# EAGLE board MBot (EAGLE 6.2), part 1 of 2
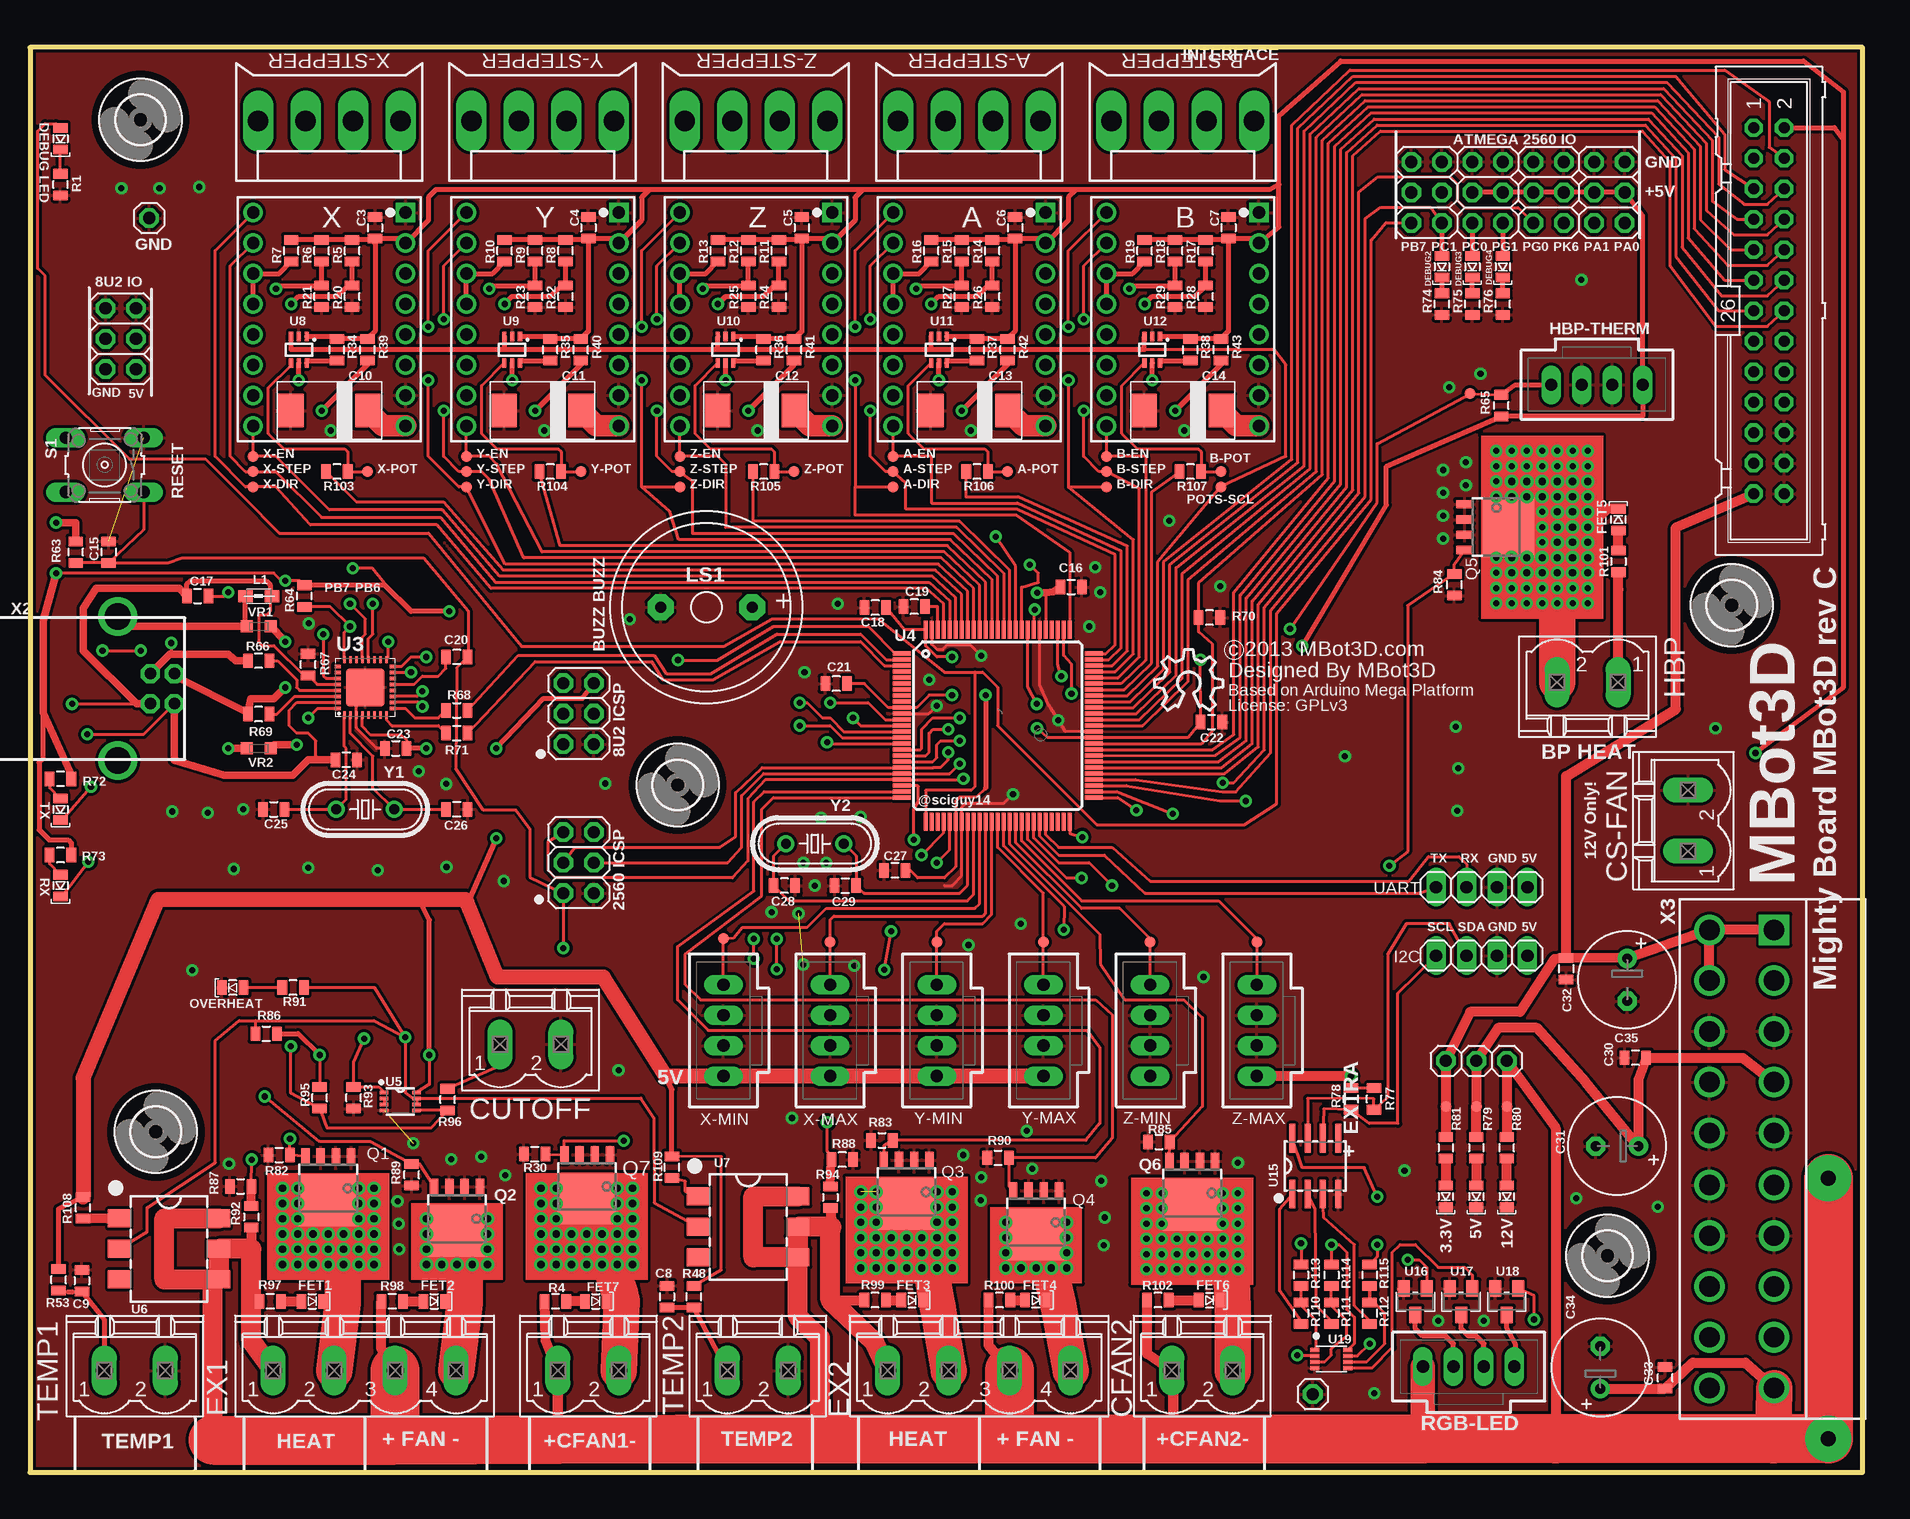
[diagram p2: board, top side]
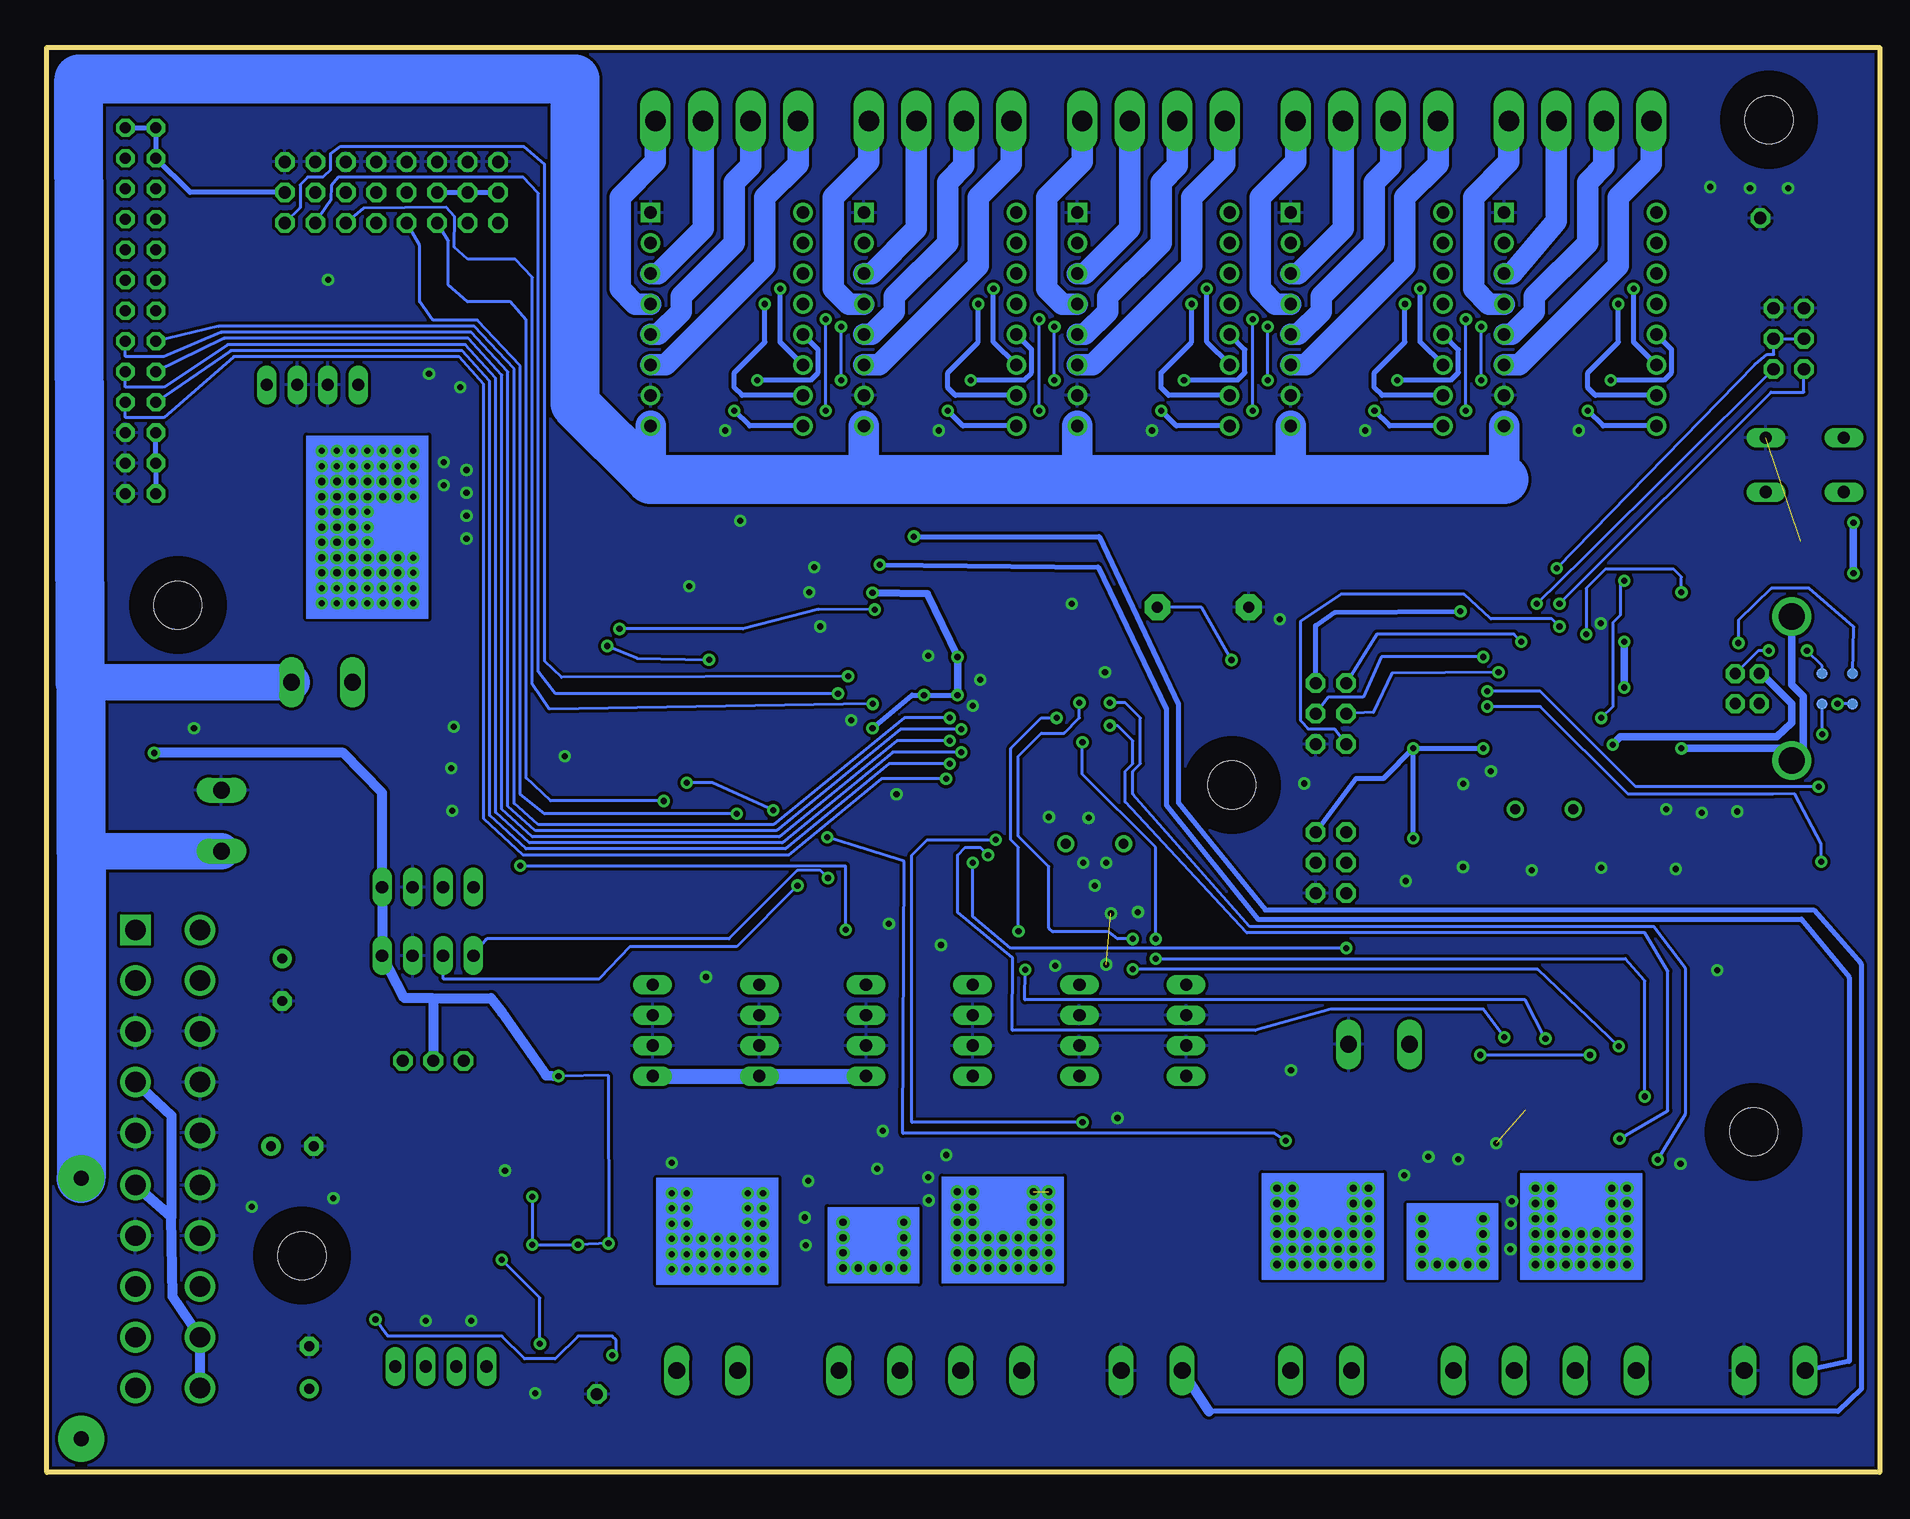
[diagram p3: board, bottom side, seen from below]

Size 152.72 x 118.75 mm. Coordinates in mm from the lower left corner, seen from the top.
Outline: 0,0 152.72,0 152.72,118.75 0,118.75 0,0
Copper layers (1*16): Top 0.035mm / dielectric 1.5mm / Bottom 0.035mm
Design rules: minimum track width 8mil, minimum drill 20mil, track to track 4mil, track to pad 4mil, pad to pad 4mil, via to via 4mil, smd to smd 0mil, copper to edge 10mil, drill to drill 8mil, minimum pad ring 12mil, minimum via ring 10mil, stop-mask expansion 4mil, vias tented up to drill 25mil, thermal gap 10mil
Net classes: 0 default: width 0.203 mm, drill 0.508 mm, clearance 0.203 mm; 1 24V: width 0.889 mm, drill 0.635 mm, clearance 0.508 mm; 2 gnd: width 0.381 mm, drill 0.508 mm, clearance 0.254 mm; 3 5V: width 0.381 mm, drill 0.508 mm, clearance 0.254 mm; 4 3.3V: width 0.381 mm, drill 0.508 mm, clearance 0.254 mm; 5 DC Motor: width 0.762 mm, drill 0.635 mm, clearance 0.254 mm

## Footprints (pad centres in the part's own frame; a part is rotated, then mirrored left to right if it is on the bottom)
LED-0805 = smd 1.2 x 0.8: A 0,-0.9; C 0,0.9
4,0HOLE-3,0KEEPOUT = hole 4: 0,0
MSTBV2 = drill 1.397 long: 1 -2.54,0; 2 2.54,0
TP09R = smd 0.9 x 0.9: TP 0,0
KK-156-4 = drill 1.7 pad 2.184 long: 1 -5.94,0; 2 -1.98,0; 3 1.98,0; 4 5.94,0
BOTSTEP17-INV = drill 1.016 square: 1 6.35,8.89 | drill 1.016: 2 6.35,6.35; 3 6.35,3.81; 4 6.35,1.27; 5 6.35,-1.27; 6 6.35,-3.81; 7 6.35,-6.35; 8 6.35,-8.89; 9 -6.35,-8.89; 10 -6.35,-6.35; 11 -6.35,-3.81; 12 -6.35,-1.27; 13 -6.35,1.27; 14 -6.35,3.81; 15 -6.35,6.35; 16 -6.35,8.89
0805 = smd 0.8 x 1.2: 1 -0.9,0; 2 0.9,0
CAP2917 = smd 2.1 x 2.8: 1 -3.2,0; 2 3.2,0
E3,5-8 = drill 0.813 pad 1.6: + -1.778,0 | drill 0.813 pad 1.6 octagon: - 1.778,0
MSTBV4 = drill 1.397 long: 1 -7.62,0; 2 -2.54,0; 3 2.54,0; 4 7.62,0
70543-04 = drill 1.016 long: 1 -3.81,0; 2 -1.27,0; 3 1.27,0; 4 3.81,0
1X04 = drill 1.016 long: 1 -3.81,0; 2 -1.27,0; 3 1.27,0; 4 3.81,0
2X03 = drill 1.016 octagon: 1 -2.54,-1.27; 2 -2.54,1.27; 3 0,-1.27; 4 0,1.27; 5 2.54,-1.27; 6 2.54,1.27
ML26 = drill 0.914 octagon: 1 -15.24,-1.27; 2 -15.24,1.27; 3 -12.7,-1.27; 4 -12.7,1.27; 5 -10.16,-1.27; 6 -10.16,1.27; 7 -7.62,-1.27; 8 -7.62,1.27; 9 -5.08,-1.27; 10 -5.08,1.27; 11 -2.54,-1.27; 12 -2.54,1.27; 13 0,-1.27; 14 0,1.27; 15 2.54,-1.27; 16 2.54,1.27; 17 5.08,-1.27; 18 5.08,1.27; 19 7.62,-1.27; 20 7.62,1.27; 21 10.16,-1.27; 22 10.16,1.27; 23 12.7,-1.27; 24 12.7,1.27; 25 15.24,-1.27; 26 15.24,1.27
1X01 = drill 1.016 octagon: 1 0,0
0805' = smd 1.2 x 1: 1 -1.1,0; 2 1.1,0
F/QMB = drill 0.914 pad 2.159 octagon: + 3.81,0; - -3.81,0
SOT669 = smd 0.7 x 1.4: 1 -1.905,-3.92; 2 -0.635,-3.92; 3 0.635,-3.92; 4 1.905,-3.92 | smd 5 x 4.3: MB 0,-0.27
B3F-10XX = drill 1.016 long: 1 -3.251,2.261; 2 3.251,2.261; 3 -3.251,-2.261; 4 3.251,-2.261
QFN32 = smd 0.6 x 0.3: 1 -2.3,1.75; 2 -2.3,1.25; 3 -2.3,0.75; 4 -2.3,0.25; 5 -2.3,-0.25; 6 -2.3,-0.75; 7 -2.3,-1.25; 8 -2.3,-1.75; 17 2.3,-1.75; 18 2.3,-1.25; 19 2.3,-0.75; 20 2.3,-0.25; 21 2.3,0.25; 22 2.3,0.75; 23 2.3,1.25; 24 2.3,1.75 | smd 0.3 x 0.6: 9 -1.75,-2.3; 10 -1.25,-2.3; 11 -0.75,-2.3; 12 -0.25,-2.3; 13 0.25,-2.3; 14 0.75,-2.3; 15 1.25,-2.3; 16 1.75,-2.3; 25 1.75,2.3; 26 1.25,2.3; 27 0.75,2.3; 28 0.25,2.3; 29 -0.25,2.3; 30 -0.75,2.3; 31 -1.25,2.3; 32 -1.75,2.3 | smd 3.2 x 3.2: EXP 0,0
TQFP100 = smd 1.5 x 0.35: 1 -8,6; 2 -8,5.5; 3 -8,5; 4 -8,4.5; 5 -8,4; 6 -8,3.5; 7 -8,3; 8 -8,2.5; 9 -8,2; 10 -8,1.5; 11 -8,1; 12 -8,0.5; 13 -8,0; 14 -8,-0.5; 15 -8,-1; 16 -8,-1.5; 17 -8,-2; 18 -8,-2.5; 19 -8,-3; 20 -8,-3.5; 21 -8,-4; 22 -8,-4.5; 23 -8,-5; 24 -8,-5.5; 25 -8,-6; 51 8,-6; 52 8,-5.5; 53 8,-5; 54 8,-4.5; 55 8,-4; 56 8,-3.5; 57 8,-3; 58 8,-2.5; 59 8,-2; 60 8,-1.5; 61 8,-1; 62 8,-0.5; 63 8,0; 64 8,0.5; 65 8,1; 66 8,1.5; 67 8,2; 68 8,2.5; 69 8,3; 70 8,3.5; 71 8,4; 72 8,4.5; 73 8,5; 74 8,5.5; 75 8,6 | smd 0.35 x 1.5: 26 -6,-8; 27 -5.5,-8; 28 -5,-8; 29 -4.5,-8; 30 -4,-8; 31 -3.5,-8; 32 -3,-8; 33 -2.5,-8; 34 -2,-8; 35 -1.5,-8; 36 -1,-8; 37 -0.5,-8; 38 0,-8; 39 0.5,-8; 40 1,-8; 41 1.5,-8; 42 2,-8; 43 2.5,-8; 44 3,-8; 45 3.5,-8; 46 4,-8; 47 4.5,-8; 48 5,-8; 49 5.5,-8; 50 6,-8; 76 6,8; 77 5.5,8; 78 5,8; 79 4.5,8; 80 4,8; 81 3.5,8; 82 3,8; 83 2.5,8; 84 2,8; 85 1.5,8; 86 1,8; 87 0.5,8; 88 0,8; 89 -0.5,8; 90 -1,8; 91 -1.5,8; 92 -2,8; 93 -2.5,8; 94 -3,8; 95 -3.5,8; 96 -4,8; 97 -4.5,8; 98 -5,8; 99 -5.5,8; 100 -6,8
US8 = smd 0.3 x 0.7: 1 -0.75,-1.35; 2 -0.25,-1.35; 3 0.25,-1.35; 4 0.75,-1.35; 5 0.75,1.35; 6 0.25,1.35; 7 -0.25,1.35; 8 -0.75,1.35
AQV25-DIPSM = smd 1.5 x 1.9: 1 -2.54,-4.15; 2 0,-4.15; 3 2.54,-4.15; 4 2.54,4.15; 5 0,4.15; 6 -2.54,4.15
SC70-6L = smd 0.35 x 0.8: 1 -0.65,-1.1; 2 0,-1.1; 3 0.65,-1.1; 4 0.65,1.1; 5 0,1.1; 6 -0.65,1.1
SO8 = smd 0.5 x 2.388: 1 -1.905,-2.324; 2 -0.635,-2.324; 3 0.635,-2.324; 4 1.905,-2.324; 5 1.905,2.324; 6 0.635,2.324; 7 -0.635,2.324; 8 -1.905,2.324
SOT-23 = smd 1 x 1.4: 1 -0.95,-1.1; 2 0.95,-1.1; 3 0,1.1
VSSOP8 = smd 0.4 x 0.75: 1 -0.75,-1.375; 2 -0.25,-1.375; 3 0.25,-1.375; 4 0.75,-1.375; 5 0.75,1.375; 6 0.25,1.375; 7 -0.25,1.375; 8 -0.75,1.375
CT/CN0603 = smd 1 x 1: 1 -1,0; 2 1,0
SMARTPRJ_PN61729 = drill 0.95 octagon: 1 1.25,4.71; 2 -1.25,4.71; 3 -1.25,2.71; 4 1.25,2.71 | drill 2.2: P$1 -6,0; P$2 6,0
5569 = drill 1.7 pad 2.54 square: 1 -19.09,3.81 | drill 1.7 pad 2.54: 2 -19.09,-1.575; 3 -14.86,3.81; 4 -14.86,-1.575; 5 -10.63,3.81; 6 -10.63,-1.575; 7 -6.4,3.81; 8 -6.4,-1.575; 9 -2.17,3.81; 10 -2.17,-1.575; 11 2.17,3.81; 12 2.17,-1.575; 13 6.4,3.81; 14 6.4,-1.575; 15 10.63,3.81; 16 10.63,-1.575; 17 14.86,3.81; 18 14.86,-1.575; 19 19.09,3.81; 20 19.09,-1.575
HC49/S = drill 0.813: 1 -2.413,0; 2 2.413,0

## Placement (x,y rotation side)
3.3V  GREEN  [LED-0805]  117.98,22.99 180 top
5V  GREEN  [LED-0805]  120.52,22.99 180 top
12V  GREEN  [LED-0805]  123.06,22.99 180 top
$$$$$$U$1  [4,0HOLE-3,0KEEPOUT]  10.49,28.38 0 top
$$U$1  [4,0HOLE-3,0KEEPOUT]  131.46,18.05 0 top
$$U$7  [4,0HOLE-3,0KEEPOUT]  141.81,72.26 0 top
$$U$8  [4,0HOLE-3,0KEEPOUT]  53.98,57.28 0 top
+CFAN1-  CFAN1  [MSTBV2]  46.53,8.48 0 top
A-DIR  TPSQTP09R  [TP09R]  71.93,82.12 0 top
A-EN  TPSQTP09R  [TP09R]  71.93,84.66 0 top
A-POT  TPSQTP09R  [TP09R]  81.46,83.39 0 top
A-STEP  TPSQTP09R  [TP09R]  71.93,83.39 0 top
A-STEPPER  [KK-156-4]  78.28,112.6 180 top
B-DIR  TPSQTP09R  [TP09R]  89.71,82.12 0 top
B-EN  TPSQTP09R  [TP09R]  89.71,84.66 0 top
B-POT  TPSQTP09R  [TP09R]  99.24,83.39 0 top
B-STEP  TPSQTP09R  [TP09R]  89.71,83.39 0 top
B-STEPPER  [KK-156-4]  96.06,112.6 180 top
BOTSTEP-A  BOTSTEP17  [BOTSTEP17-INV]  78.28,96.09 0 top
BOTSTEP-B  BOTSTEP17  [BOTSTEP17-INV]  96.06,96.09 0 top
BOTSTEP-X  BOTSTEP17  [BOTSTEP17-INV]  24.94,96.09 0 top
BOTSTEP-Y  BOTSTEP17  [BOTSTEP17-INV]  42.72,96.09 0 top
BOTSTEP-Z  BOTSTEP17  [BOTSTEP17-INV]  60.5,96.09 0 top
C3  100nF  [0805]  28.75,103.71 270 top
C4  100nF  [0805]  46.53,103.71 270 top
C5  100nF  [0805]  64.31,103.71 270 top
C6  100nF  [0805]  82.09,103.71 270 top
C7  100nF  [0805]  99.87,103.71 270 top
C8  10uF  [0805]  53.09,14.63 270 top
C9  10uF  [0805]  4.32,15.96 270 top
C10  47uF  [CAP2917]  24.94,88.47 180 top
C11  47uF  [CAP2917]  42.72,88.47 180 top
C12  47uF  [CAP2917]  60.5,88.47 180 top
C13  47uF  [CAP2917]  78.28,88.47 180 top
C14  47uF  [CAP2917]  96.06,88.47 180 top
C15  22pF  [0805]  6.55,76.68 270 top
C16  100nF  [0805]  86.77,73.77 0 top
C17  1uF  [0805]  13.97,73.03 0 top
C18  100nF  [0805]  70.43,72.06 180 top
C19  100nF  [0805]  73.69,72.14 180 top
C20  100nF  [0805]  35.56,67.94 180 top
C21  100nF  [0805]  67.18,65.72 180 top
C22  100nF  [0805]  98.45,62.52 0 top
C23  100nF  [0805]  30.48,60.33 0 top
C24  100nF  [0805]  26.35,59.37 180 top
C25  22pF  [0805]  20.32,55.24 0 top
C26  22pF  [0805]  35.56,55.24 180 top
C27  100nF  [0805]  72.07,50.16 180 top
C28  22pF  [0805]  62.87,48.9 180 top
C29  22pF  [0805]  67.94,48.9 0 top
C30  100nF  [0805]  133.78,34.54 180 top
C31  100uF  [E3,5-8]  132.26,27.18 180 top
C32  100nF  [0805]  128.02,41.96 270 top
C33  100nF  [0805]  136.26,7.87 90 top
C34  100uF  [E3,5-8]  130.86,8.74 90 top
C35  100uF  [E3,5-8]  133.1,41.05 270 top
CFAN2  MSTBV2  [MSTBV2]  97.69,8.48 0 top
CS-FAN  MSTBV2  [MSTBV2]  138.18,54.31 90 top
CUTOFF  MSTBV2  [MSTBV2]  41.71,35.66 0 top
DEBUG1  GREEN  [LED-0805]  2.54,111.12 180 top
DEBUG2  GREEN  [LED-0805]  117.65,100.46 180 top
DEBUG3  GREEN  [LED-0805]  120.19,100.46 180 top
DEBUG4  GREEN  [LED-0805]  122.73,100.46 180 top
EX1  MSTBV4  [MSTBV4]  27.89,8.48 0 top
EX2  MSTBV4  [MSTBV4]  79.1,8.48 0 top
FET1  GREEN  [LED-0805]  23.52,14.25 270 top
FET2  GREEN  [LED-0805]  33.68,14.25 270 top
FET3  GREEN  [LED-0805]  73.51,14.35 270 top
FET4  GREEN  [LED-0805]  83.82,14.35 270 top
FET5  GREEN  [LED-0805]  132.36,79.4 0 top
FET6  GREEN  [LED-0805]  98.3,14.35 270 top
FET7  GREEN  [LED-0805]  47.14,14.25 270 top
HBP  MSTBV2  [MSTBV2]  129.79,65.84 180 top
HBP-THERM  C-GRID-04-70543  [70543-04]  130.58,90.63 180 top
I2C  DNP  [1X04]  120.98,43.05 180 top
ICSP1  8U2-ICSP-DNP  [2X03]  45.72,63.22 270 top
ICSP2  ATMEGA-ICSP-DNP  [2X03]  45.72,50.8 270 top
INTERFACE  [ML26]  144.91,96.8 270 top
JP1  3.3V  [1X01]  117.98,34.29 0 top
JP2  DNP  [1X01]  9.93,104.52 0 top
JP3  DNP  [2X03]  7.57,94.46 270 top
JP4  DNP  [2X03]  116.38,106.65 270 top
JP5  DNP  [2X03]  121.46,106.65 270 top
JP6  DNP  [2X03]  126.54,106.65 270 top
JP7  DNP  [2X03]  131.62,106.65 270 top
JP8  GND  [1X01]  106.9,6.52 0 top
JP9  12V  [1X01]  123.06,34.29 0 top
JP10  5V  [1X01]  120.52,34.29 0 top
L1  BLM21  [0805']  19.05,73.03 180 top
LOGO2  OSHW_LOGO_10MILX0200-NT  [OSHW_10X200_NOTEXT]  93.73,63.5 0 top
LS1  F/QMB  [F/QMB]  56.36,72.09 0 top
OVERHEAT  RED  [LED-0805]  16.89,40.39 90 top
POTS-SCL  TPSQTP09R  [TP09R]  99.24,82.12 0 top
Q1  PSMN7R0-30YL  [SOT669]  24.85,22.4 180 top
Q2  PSMN7R0-30YL  [SOT669]  35.59,19.86 180 top
Q3  PSMN7R0-30YL  [SOT669]  73.05,22.1 180 top
Q4  PSMN7R0-30YL  [SOT669]  83.85,19.56 180 top
Q5  PSMN7R0-30YL  [SOT669]  123.47,78.77 270 top
Q6  PSMN7R0-30YL  [SOT669]  96.85,22 180 top
Q7  PSMN7R0-30YL  [SOT669]  46.43,22.56 180 top
R1  1K  [0805]  2.54,107.31 90 top
R4  2.21K  [0805]  43.79,14.25 180 top
R5  0  [0805]  26.85,101.8 90 top
R6  0  [0805]  24.31,101.8 90 top
R7  10K  [0805]  21.77,101.8 90 top
R8  0  [0805]  44.63,101.8 90 top
R9  0  [0805]  42.09,101.8 90 top
R10  10K  [0805]  39.55,101.8 90 top
R11  0  [0805]  62.41,101.8 90 top
R12  0  [0805]  59.87,101.8 90 top
R13  10K  [0805]  57.33,101.8 90 top
R14  0  [0805]  80.19,101.8 90 top
R15  0  [0805]  77.65,101.8 90 top
R16  10K  [0805]  75.11,101.8 90 top
R17  0  [0805]  97.97,101.8 90 top
R18  0  [0805]  95.43,101.8 90 top
R19  10K  [0805]  92.89,101.8 90 top
R20  DNP  [0805]  26.85,97.99 90 top
R21  DNP  [0805]  24.31,97.99 90 top
R22  DNP  [0805]  44.63,97.99 90 top
R23  DNP  [0805]  42.09,97.99 90 top
R24  DNP  [0805]  62.41,97.99 90 top
R25  DNP  [0805]  59.87,97.99 90 top
R26  DNP  [0805]  80.19,97.99 90 top
R27  DNP  [0805]  77.65,97.99 90 top
R28  DNP  [0805]  97.97,97.99 90 top
R29  DNP  [0805]  95.43,97.99 90 top
R30  4.7K  [0805]  42.06,26.52 0 top
R34  10K  [0805]  25.58,93.55 90 top
R35  10K  [0805]  43.36,93.55 90 top
R36  10K  [0805]  61.14,93.55 90 top
R37  10K  [0805]  78.92,93.55 90 top
R38  10K  [0805]  96.7,93.55 90 top
R39  4.7K  [0805]  28.12,93.55 90 top
R40  4.7K  [0805]  45.9,93.55 90 top
R41  4.7K  [0805]  63.68,93.55 90 top
R42  4.7K  [0805]  81.46,93.55 90 top
R43  4.7K  [0805]  99.24,93.55 90 top
R48  4.7K  [0805]  55.32,14.63 90 top
R53  4.7K  [0805]  2.39,16.05 90 top
R63  10K  [0805]  3.81,76.68 90 top
R64  10K  [0805]  22.86,73.03 90 top
R65  100K  [0805]  122.61,88.9 90 top
R66  22  [0805]  19.05,67.63 180 top
R67  0  [0805]  23.18,67.31 90 top
R68  1K  [0805]  35.56,63.5 0 top
R69  22  [0805]  19.05,63.18 180 top
R70  10K  [0805]  98.29,71.22 180 top
R71  1K  [0805]  35.56,61.59 0 top
R72  1K  [0805]  2.54,57.78 180 top
R73  1K  [0805]  2.54,51.44 180 top
R74  1K  [0805]  117.65,97.36 90 top
R75  1K  [0805]  120.19,97.36 90 top
R76  1K  [0805]  122.73,97.36 90 top
R77  4.7K  [0805]  112.01,31.11 90 top
R78  4.7K  [0805]  110.08,31.11 90 top
R79  1K  [0805]  120.52,27.05 270 top
R80  2.21K  [0805]  123.06,27.05 90 top
R81  1K  [0805]  117.98,27.05 270 top
R82  4.7K  [0805]  20.76,26.44 0 top
R83  4.7K  [0805]  70.99,27.66 0 top
R84  4.7K  [0805]  118.69,73.96 90 top
R85  4.7K  [0805]  94.08,27.53 0 top
R86  10k  [0805]  19.68,36.55 0 top
R87  2.21K  [0805]  17.55,23.83 0 top
R88  2.21K  [0805]  67.69,26.06 180 top
R89  4.7K  [0805]  31.8,24.79 90 top
R90  4.7K  [0805]  80.67,26.21 0 top
R91  1K  [0805]  21.92,40.39 180 top
R92  10k  [0805]  18.44,21.29 270 top
R93  10k  [0805]  26.97,31.22 90 top
R94  10k  [0805]  66.7,22.91 270 top
R95  10k  [0805]  24.13,31.22 90 top
R96  499  [0805]  34.8,31.06 90 top
R97  2.21K  [0805]  20.03,14.25 180 top
R98  2.21K  [0805]  30.19,14.25 180 top
R99  2.21K  [0805]  70.42,14.35 180 top
R100  2.21K  [0805]  80.78,14.35 180 top
R101  2.21K  [0805]  132.36,75.91 270 top
R102  2.21K  [0805]  93.99,14.35 180 top
R103  1K  [0805]  25.58,83.39 180 top
R104  1K  [0805]  43.36,83.39 180 top
R105  1K  [0805]  61.14,83.39 180 top
R106  1K  [0805]  78.92,83.39 180 top
R107  1K  [0805]  96.7,83.39 180 top
R108  4.7K  [0805]  4.42,22.05 90 top
R109  4.7K  [0805]  53.49,25.43 90 top
R110  100K  [0805]  105.92,13.26 270 top
R111  100K  [0805]  108.46,13.26 270 top
R112  100K  [0805]  111.63,13.26 270 top
R113  1M  [0805]  105.92,16.43 270 top
R114  1M  [0805]  108.46,16.43 270 top
R115  1M  [0805]  111.63,16.43 270 top
RGB-LED  C-GRID-04-70543  [70543-04]  119.89,8.81 0 top
RX  GREEN  [LED-0805]  2.54,48.9 180 top
S1  [B3F-10XX]  6.22,83.95 180 top
TEMP1  MSTBV2  [MSTBV2]  8.74,8.48 0 top
TEMP2  MSTBV2  [MSTBV2]  60.66,8.48 0 top
TP27  TPSQTP09R  [TP09R]  120.02,89.89 0 top
TP28  TPSQTP09R  [TP09R]  57.78,44.5 0 top
TP29  TPSQTP09R  [TP09R]  66.67,44.2 0 top
TP30  TPSQTP09R  [TP09R]  75.56,44.2 0 top
TP31  TPSQTP09R  [TP09R]  84.45,44.2 0 top
TP32  TPSQTP09R  [TP09R]  93.34,44.2 0 top
TP33  TPSQTP09R  [TP09R]  102.23,44.2 0 top
TP34  TPSQTP09R  [TP09R]  120.52,30.48 90 top
TP35  TPSQTP09R  [TP09R]  123.06,30.48 90 top
TP36  TPSQTP09R  [TP09R]  117.98,30.48 90 top
TX  GREEN  [LED-0805]  2.54,55.24 180 top
U3  ATMEGA8U2-MU  [QFN32]  27.94,65.41 90 top
U4  ATMEGA2560-16AU  [TQFP100]  80.64,62.23 0 top
U5  NC7WZ02  [US8]  30.86,30.91 270 top
U6  AQV25  [AQV25-DIPSM]  11.58,18.62 270 top
U7  AQV25  [AQV25-DIPSM]  59.84,20.45 270 top
U8  MCP4018  [SC70-6L]  22.4,93.55 180 top
U9  MCP4018  [SC70-6L]  40.18,93.55 180 top
U10  MCP4018  [SC70-6L]  57.96,93.55 180 top
U11  MCP4018  [SC70-6L]  75.74,93.55 180 top
U12  MCP4018  [SC70-6L]  93.52,93.55 180 top
U15  PCA9533  [SO8]  107.11,25.51 0 top
U16  FDV301N  [SOT-23]  115.44,14.21 180 top
U17  FDV301N  [SOT-23]  119.25,14.21 180 top
U18  FDV301N  [SOT-23]  123.06,14.21 180 top
U19  74HC3G14DC  [VSSOP8]  108.46,9.45 270 top
U$1  [4,0HOLE-3,0KEEPOUT]  9.21,112.71 0 top
UART  DNP  [1X04]  120.98,48.77 180 top
UGND  TPSQTP09R  [TP09R]  2.24,64.03 0 bottom
USB+  TPSQTP09R  [TP09R]  2.24,66.57 0 bottom
USB-  TPSQTP09R  [TP09R]  4.78,66.57 0 bottom
UVCC  TPSQTP09R  [TP09R]  4.78,64.03 0 bottom
VR1  PGB1010604  [CT/CN0603]  19.05,70.48 0 top
VR2  PGB1010604  [CT/CN0603]  19.05,60.33 0 top
X2  [SMARTPRJ_PN61729]  7.32,65.3 270 top
X3  [5569]  141.53,26.11 270 top
X-DIR  TPSQTP09R  [TP09R]  18.59,82.12 0 top
X-EN  TPSQTP09R  [TP09R]  18.59,84.66 0 top
X-MAX  C-GRID-04-70543  [70543-04]  66.67,36.83 90 top
X-MIN  C-GRID-04-70543  [70543-04]  57.78,36.83 90 top
X-POT  TPSQTP09R  [TP09R]  28.12,83.39 0 top
X-STEP  TPSQTP09R  [TP09R]  18.59,83.39 0 top
X-STEPPER  [KK-156-4]  24.94,112.6 180 top
Y1  16MHz  [HC49/S]  27.94,55.24 0 top
Y2  16MHz  [HC49/S]  65.41,52.39 0 top
Y-DIR  TPSQTP09R  [TP09R]  36.37,82.12 0 top
Y-EN  TPSQTP09R  [TP09R]  36.37,84.66 0 top
Y-MAX  C-GRID-04-70543  [70543-04]  84.45,36.83 90 top
Y-MIN  C-GRID-04-70543  [70543-04]  75.56,36.83 90 top
Y-POT  TPSQTP09R  [TP09R]  45.9,83.39 0 top
Y-STEP  TPSQTP09R  [TP09R]  36.37,83.39 0 top
Y-STEPPER  [KK-156-4]  42.72,112.6 180 top
Z-DIR  TPSQTP09R  [TP09R]  54.15,82.12 0 top
Z-EN  TPSQTP09R  [TP09R]  54.15,84.66 0 top
Z-MAX  C-GRID-04-70543  [70543-04]  102.23,36.83 90 top
Z-MIN  C-GRID-04-70543  [70543-04]  93.34,36.83 90 top
Z-POT  TPSQTP09R  [TP09R]  63.68,83.39 0 top
Z-STEP  TPSQTP09R  [TP09R]  54.15,83.39 0 top
Z-STEPPER  [KK-156-4]  60.5,112.6 180 top